# EAGLE design EC60_1 (EAGLE 7.5.0)
EC60A carrier board Simple passive carrier board for an EC60A hollow shaft encoder This board is the intended base for the Cursor-EC60.brd Status: connector replaced routing finished
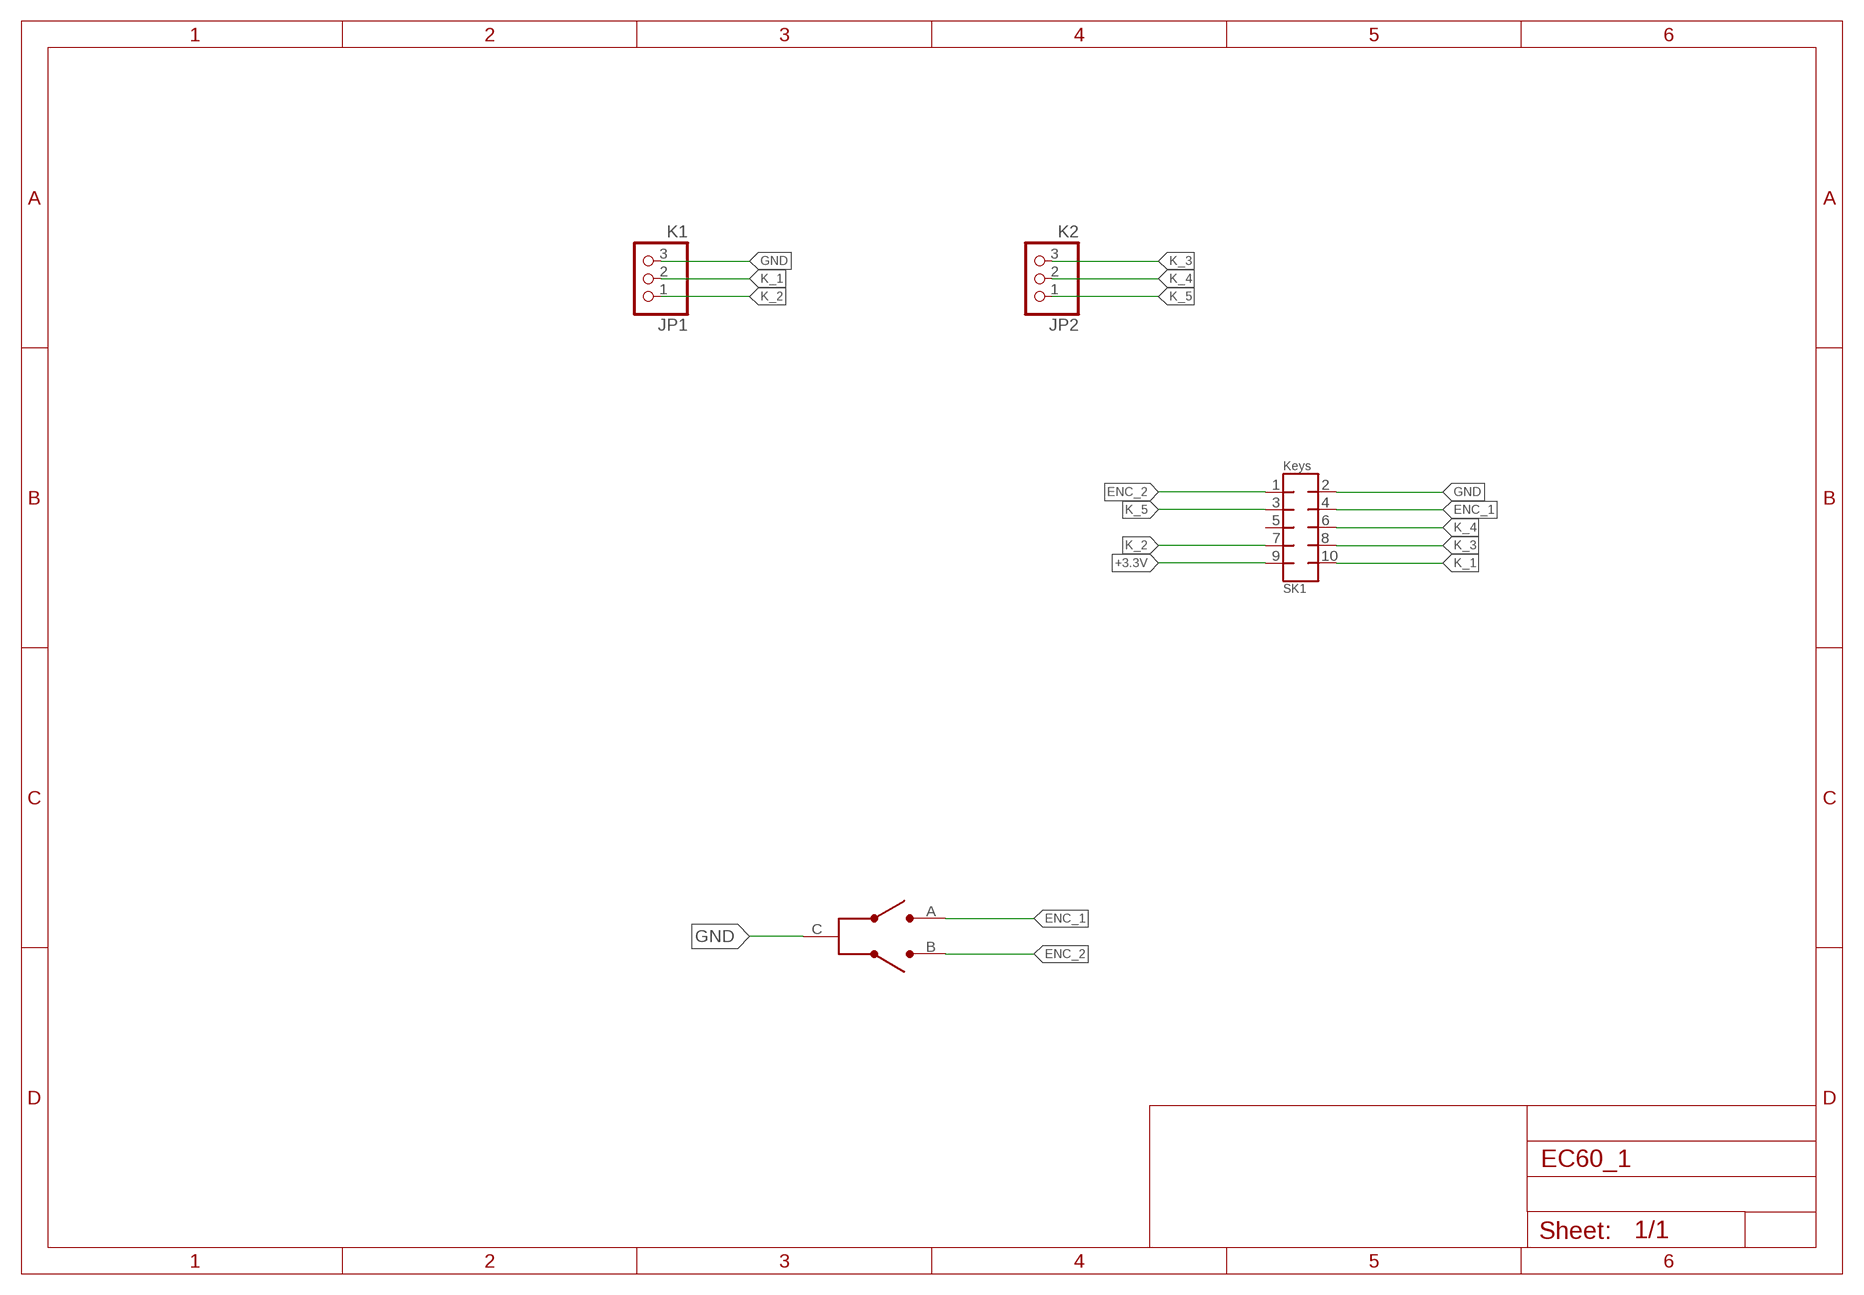
[diagram p0: schematic, sheet 1]

## Parts
JP1  K1  PINHD-1X3  [1X03]
JP2  K2  PINHD-1X3  [1X03]
SK1  Keys  MMATCH-10-PTH  [AMP-215079-10]
U$1  EC60A  [EC60A]

## Nets
+3.3V: SK1.9
ENC_1 [SUPPLY]: SK1.4 U$1.A
ENC_2 [SUPPLY]: SK1.1 U$1.B
GND [SUPPLY]: JP1.3 SK1.2 U$1.C
K_1 [SUPPLY]: JP1.2 SK1.10
K_2 [SUPPLY]: JP1.1 SK1.7
K_3 [SUPPLY]: JP2.3 SK1.8
K_4 [SUPPLY]: JP2.2 SK1.6
K_5 [SUPPLY]: JP2.1 SK1.3
Unconnected: SK1.5

## Library data of the parts
JP1 JP2 = pinhead:PINHD-1X3: PIN HEADER
SK1 = jt-con-micromatch:MMATCH-10-*: AMP Micromatch 10-pin
U$1 = ALPS-EC60A:EC60A

## Net classes
0 default: width 0.406 mm
1 SUPPLY: width 0.61 mm

## Board
EC60A carrier board Status: corrected dru OK
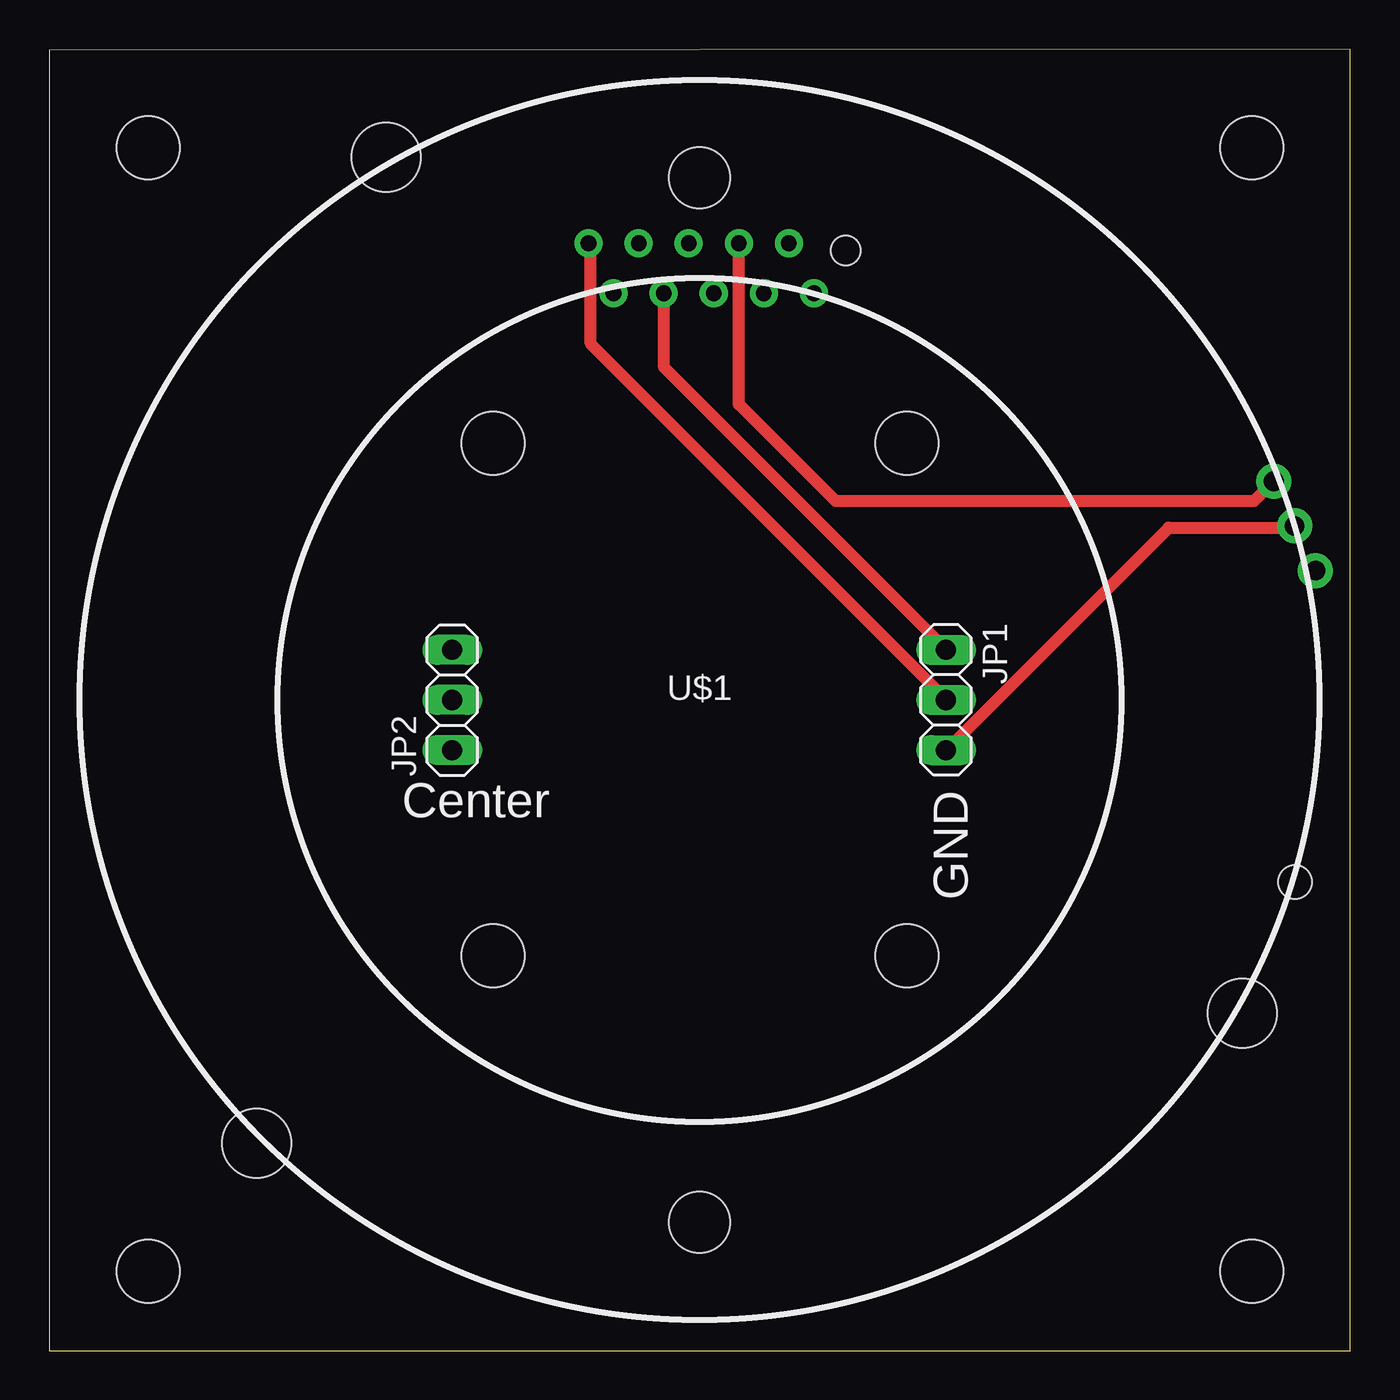
[diagram p1: board, top side]
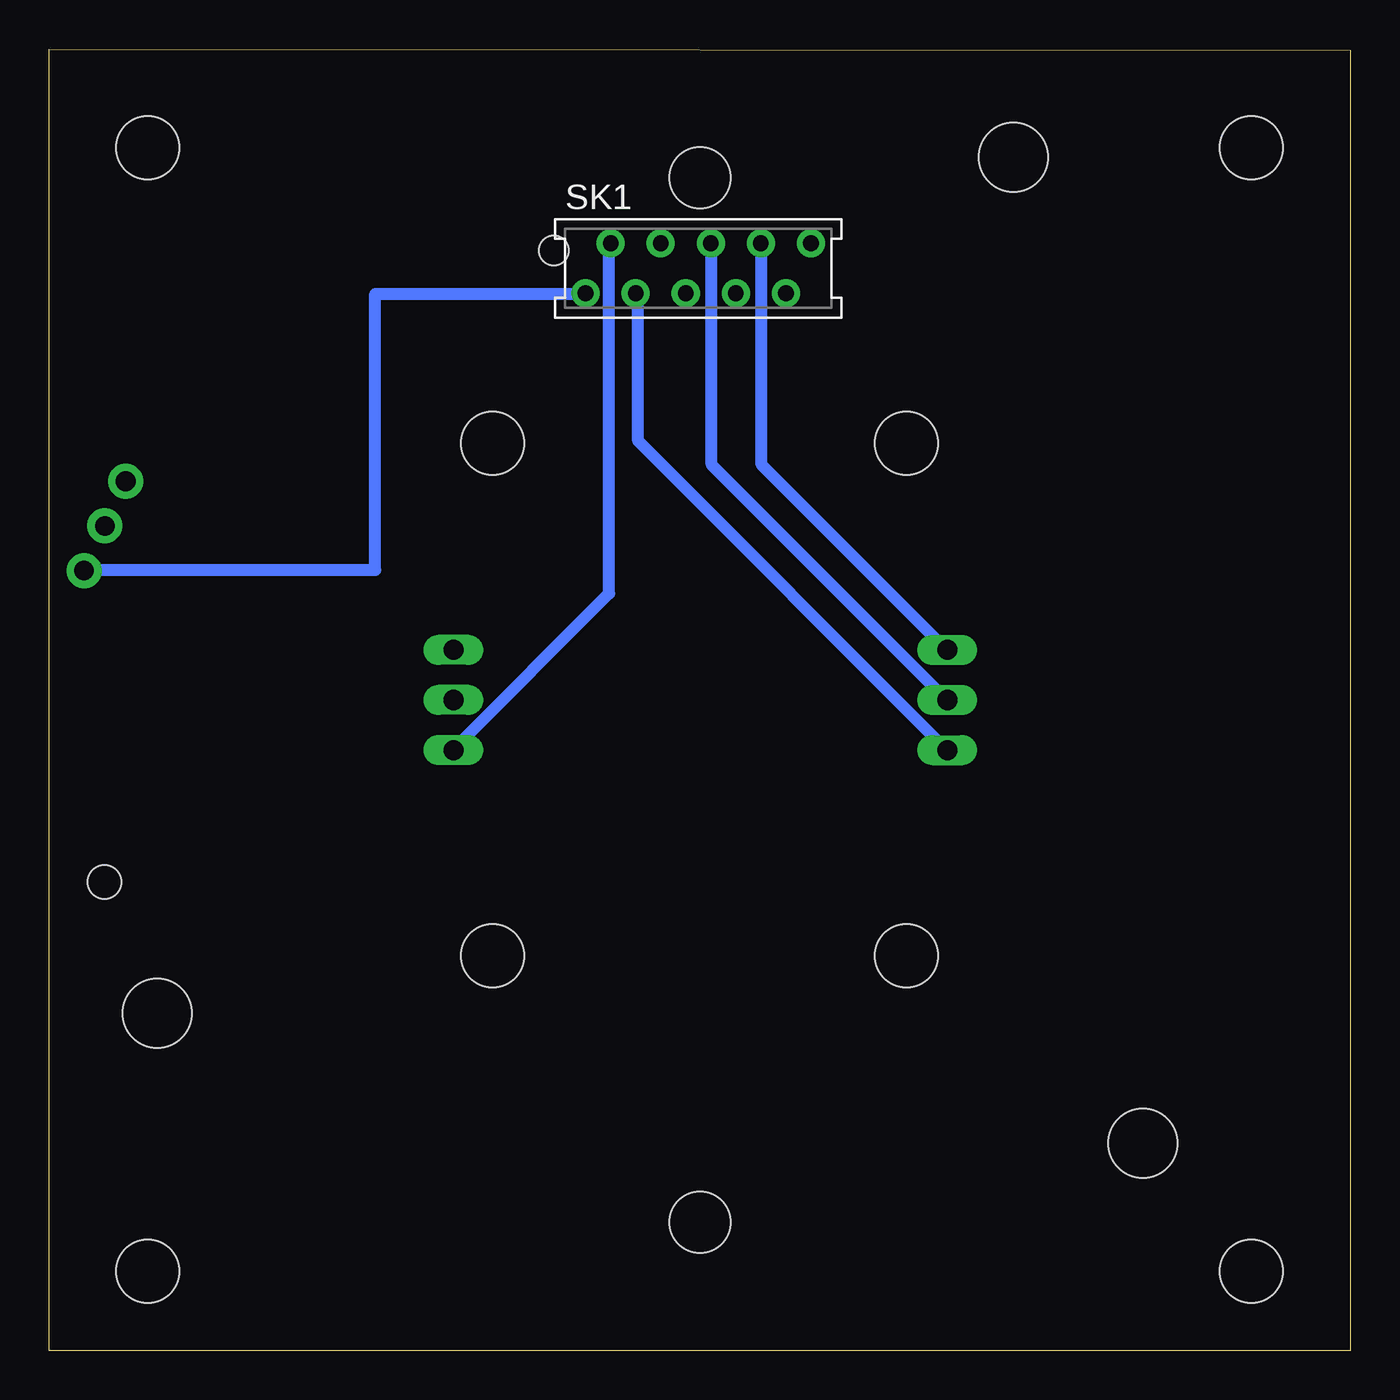
[diagram p2: board, bottom side, seen from below]

Size 66.02 x 66.01 mm. Coordinates in mm from the lower left corner, seen from the top.
Outline: 0,0 66.02,0 66.02,66.01 0,65.97 0,0
Copper layers (1*16): Top 0.035mm / dielectric 1.5mm / Bottom 0.035mm
Design rules "dirt_cheap_dirty_boards.v1": minimum track width 5mil, minimum drill 12mil, track to track 5mil, track to pad 5mil, pad to pad 5mil, via to via 5mil, smd to smd 0mil, copper to edge 10mil, drill to drill 10mil, minimum pad ring 10mil, minimum via ring 6mil, stop-mask expansion 2mil, vias tented up to drill 25mil, thermal gap 10mil
Holes 3.2 mm at 22.52,46.02 43.52,46.02 22.52,20.02 43.52,20.02 5.02,61.02 61.02,61.02 5.02,4.02 61.02,4.02

### Footprints (pad centres in the part's own frame; a part is rotated, then mirrored left to right if it is on the bottom)
1X03 = drill 1.016 long: 1 -2.54,0; 2 0,0; 3 2.54,0
AMP-215079-10 = drill 0.8 pad 1.422: 1 0,-1.27; 2 1.27,1.27; 3 2.54,-1.27; 4 3.81,1.27; 5 5.08,-1.27; 6 6.35,1.27; 7 7.62,-1.27; 8 8.89,1.27; 9 10.16,-1.27; 10 11.43,1.27 | hole 1.5: -1.62,0.905
EC60A = drill 1 pad 1.778: A 29.141,11.095; B 31.254,6.564; C 30.198,8.829 | hole 3.1: 0,26.5; 0,-26.5 | hole 3.5: -15.9,27.54; -22.486,-22.486; 27.54,-15.9 | hole 1.7: 30.219,-9.239

### Placement (x,y rotation side)
JP1  45.51,33 270 top
JP2  20.45,33 90 top
SK1  38.8,54.9 0 bottom
U$1  33,33 0 top

### Tracks (layer width: path | path; a pad name or v marks a point on that pad's centre or on a via)
ENC_1
  Top 0.61: SK1.4 35,48 39.91,43.09 61.14,43.09 U$1.A
ENC_2
  Bottom 0.61: SK1.1 38.8,53.61 49.47,53.61 49.48,39.6 64.14,39.6 U$1.B
GND
  Top 0.61: U$1.C 63.08,41.74 56.81,41.74 45.61,30.54 JP1.3
  Bottom 0.61: SK1.2 37.6,56.14 37.6,38.41 45.47,30.54 JP1.3
K_1
  Top 0.61: SK1.10 27.47,56.14 27.47,51.07 45.47,33.07 JP1.2
K_2
  Top 0.61: SK1.7 31.2,53.61 31.2,49.87 45.47,35.6 JP1.1
K_3
  Bottom 0.61: SK1.8 29.87,56.14 29.87,44.94 20.54,35.6 JP2.3
K_4
  Bottom 0.61: SK1.6 32.4,56.14 32.4,44.94 20.54,33.07 JP2.2
K_5
  Bottom 0.61: SK1.3 36.14,53.61 36.14,46.14 20.54,30.54 JP2.1

### Text on the board
tNames: Center | GND